# Altium schematic sheet Sheet2.SchDoc
size A; SheetNumber: 4; SheetTotal: 6
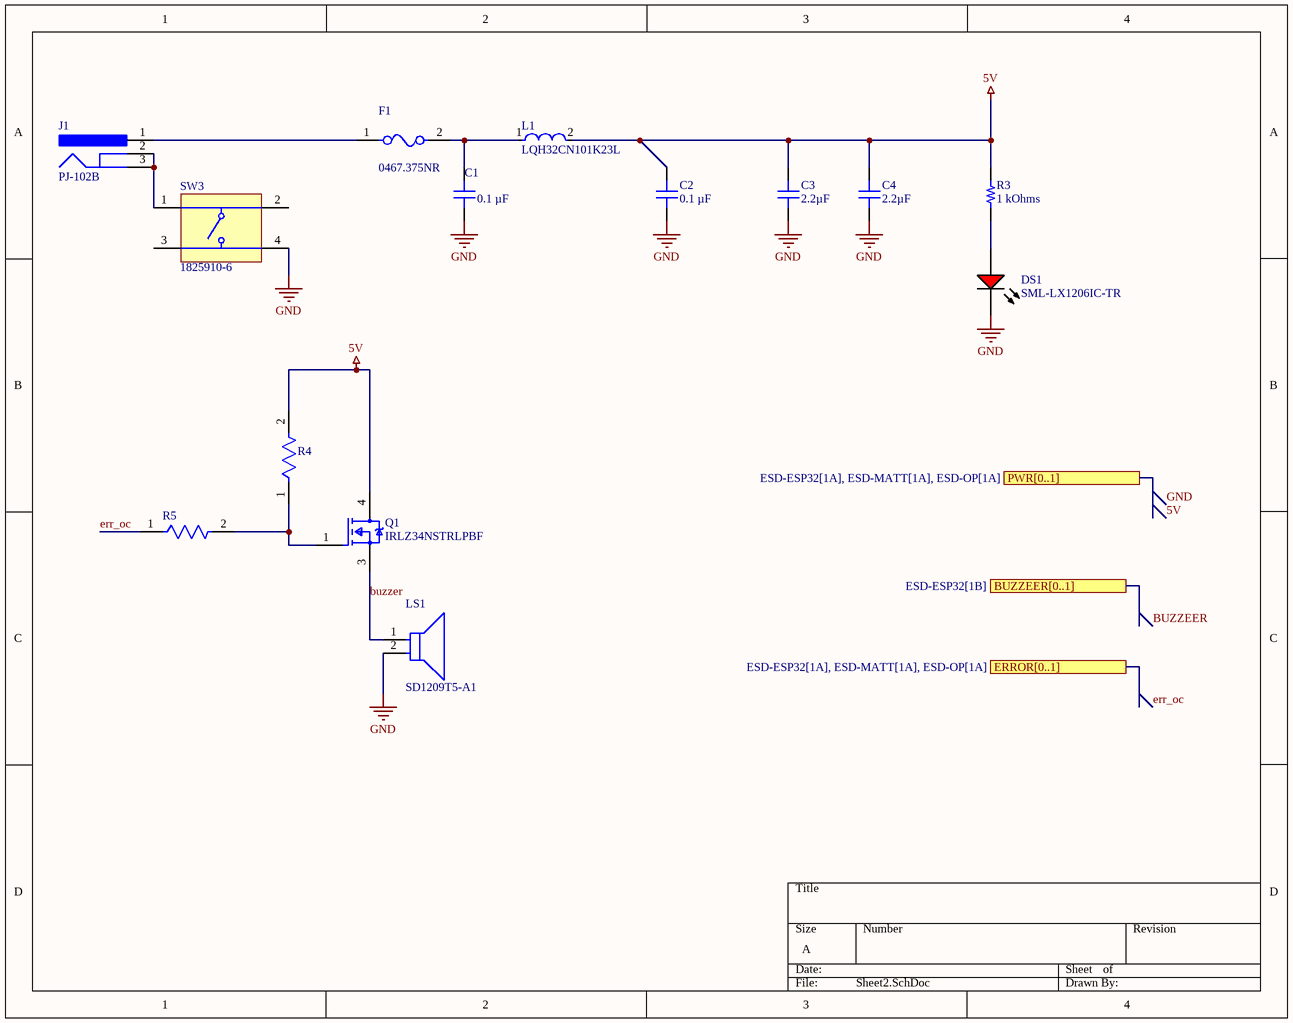
[diagram p0: Sheet2.SchDoc]

## Parts
C1  0.1 µF  [CAP 0603_1608]
C2  0.1 µF  [CAP 0603_1608]
C3  2.2µF  [CAP 0603_1608]
C4  2.2µF  [CAP 0603_1608]
DS1  SML-LX1206IC-TR  [LUMX-SML-LX1206IC_V]
F1  0467.375NR  [FP-467-MFG]
J1  PJ-102B  [CUI-PJ-102B_V]
L1  LQH32CN101K23L  [FP-LQH32CH_23-MFG]
LS1  SD1209T5-A1  [FP-SD1209-MFG]
Q1  IRLZ34NSTRLPBF  [FP-PG-TO263-3-MFG]
R3  1 kOhms  [KOA RES RK73 RN73 0402_1005]
R4  AC0603FR-072KL  [FP-AC0603-IPC_B]  (value not drawn)
R5  AC0603FR-072KL  [FP-AC0603-IPC_B]  (value not drawn)
SW3  1825910-6  [TECO-1825910-6_V]

## Ports
BUZZEER[0..1] (see ESD-ESP32[1B]), ERROR[0..1] (see ESD-ESP32[1A], ESD-MATT[1A], ESD-OP[1A]), PWR[0..1] (see ESD-ESP32[1A], ESD-MATT[1A], ESD-OP[1A])

## Nets
5V: C2.2 C3.2 C4.2 L1.2 Q1.4(D) R3.2 R4.2
GND: C1.1 C2.1 C3.1 C4.1 DS1.2(K) LS1.2(A) SW3.4
buzzer: LS1.1(C) Q1.3(S)
err_oc: R5.1
NetC1_2: C1.2 F1.2 L1.1
NetDS1_1: DS1.1(A) R3.1
NetF1_1: F1.1 J1.1
NetJ1_2: J1.2 J1.3 SW3.1
NetQ1_1: Q1.1(G) R4.1 R5.2

Not connected (* = marked no-connect by the designer): SW3 2 3

## Notes on the sheet
- Labels drawn without touching a wire or pin: 5V, BUZZEER, err_oc, GND

## Library data of the parts
C1 C2 = C0603X104J5RACAUTO: CAP CER 0.1UF 50V X7R 0603; manufacturer: KEMET; Tolerance: ±5%; Part Number: C0603X104J5RACAUTO; Value: 0.1 µF; Applications: Automotive, Boardflex Sensitive; Capacitance: 0.1 µF; componentlink1description: Datasheet; componentlink1url: https://api.kemet.com/component-edge/download/specsheet/C0603X104J5RACAUTO.pdf; componentlink2description: DigiKey Link; componentlink2url: https://www.digikey.com/en/products/detail/kemet/C0603X104J5RACAUTO/3314905; Device Package: 0603 (1608 Metric); Features: Soft Termination; lastupdated: 2/9/2024 8:10:26 PM; Lifecycle Status: Active; Minimum Order: 1; Mounting Type: Surface Mount, MLCC; Operating Temperature: -55°C ~ 125°C; Package / Case: 0603 (1608 Metric); packaging: TapeAndReel; partid: 40909; Part Status: Active; price: 0.12; Ratings: AEC-Q200; series: SMD Auto X7R Flex; Size / Dimension: 0.063" L x 0.031" W (1.60mm x 0.80mm); Supplier 1: DigiKey; Supplier Part Number 1: 399-6910-1-ND; Temperature Coefficient: X7R; Thickness (Max): 0.037" (0.95mm); Voltage - Rated: 50V
C3 C4 = 0603ZC225KAT2A: CAP CER 2.2UF 10V X7R 0603; manufacturer: AVX Corporation; Tolerance: ±10%; Part Number: 0603ZC225KAT2A; Value: 2.2µF; Applications: General Purpose; Capacitance: 2.2µF; componentlink1description: Datasheet; componentlink1url: http://datasheets.avx.com/X7RDielectric.pdf; componentlink2description: DigiKey Link; componentlink2url: http://digikey.com/product-detail/en/avx-corporation/0603ZC225KAT2A/478-11618-1-ND/8564176; Device Package: 0603 (1608 Metric); lastupdated: 9/2/2020 1:03:15 AM; Lifecycle Status: Active; Minimum Order: 1; Mounting Type: Surface Mount, MLCC; Operating Temperature: -55°C ~ 125°C; Package / Case: 0603 (1608 Metric); packaging: TapeAndReel; partid: 13741; Part Status: Active; price: 0.37; series: -; Size / Dimension: 0.063" L x 0.032" W (1.60mm x 0.81mm); Supplier 1: DigiKey; Supplier Part Number 1: 478-11618-1-ND; Temperature Coefficient: X7R; Thickness (Max): 0.037" (0.94mm); Voltage - Rated: 10V
DS1 = CMP-2000-07123-1: LED Red, 65 mW, -40 to 85 degC, 2-Pin SMD, RoHS, Tape and Reel; Manufacturer: Lumex; LED Material: GaAsP; Peak Wavelength: 635nm; Number of LEDs: 1; Viewing Angle: 160; Reverse Voltage: 5(Min)V; Lens Appearance: ColorlessNonDiffused; Intensity: 6mcd; Type: Uni-Color; Pin_Count: 2; Lens Dimensions: 2x1.6x0.5mm; Mounting: SurfaceMount; ECCN: EAR99; RoHS: Unknown; Package Description: 2-Pin Surface Mount Device, Body 3.2 x 1.5 mm; Mounting Technology: SurfaceMount; Dominant Wavelength: N/A; Supplier_Package: SMD; Supplier Standard Pack: 3,000; Color: Red; Dimension: 3.2x1.6x1.1mm; HTS: 8541402000; Part No: SML-LX1206IC-TR; Family: SML-LX1206IC; Supplier: Lumex; Datasheet URL: http://www.lumex.com/content/files/ProductAttachment/SML-LX1206IC-TR.pdf; Package Reference: SML-LX1206IC; Manufacturer URL: http://www.lumexinstruments.com/; Operating Temperature: -25to85C; Packaging: TapeandReel; Datasheet Version: Rev. J, 08/2012
F1 = CMP-08605-000028-1: FUSE BOARD MOUNT 375MA 32VAC/VDC; Manufacturer: Littelfuse; Fuse Current: 0.375A; Fuse Blow Speed: Fast; Max Fuse Dc Voltage: 32V; Fuse I2T: 0.0035A2Sec; Fuse Interrupt Dc Current: 50A; Octopart: https://octopart.com/0467.375nr-littelfuse-565971; Temperature: -55°C to +90°C; Mouser Description: Surface Mount Fuses 32V.375A VFA Slimline; Automotive: No; Category: Fuse; Temperature Range Low: -55°C; ComponentLink2Description: Datasheet; Max Fuse Ac Voltage: 32V; Lead Free: Yes; Package: 467; Manufacturer Part Number: 0467.375NR; Height: 0.432mm; RoHS: TRUE; ComponentLink2URL: https://www.littelfuse.com/~/media/electronics/datasheets/fuses/littelfuse_fuse_467_datasheet.pdf.pdf; Temperature Range High: +90°C; Device Class L1: Circuit Protection; Voltage Rating: 32V; Device Class L2: Fuses; Fuse Interrupt Ac Current: 50A; Digikey Description: FUSE BOARD MOUNT 375MA 32VAC/VDC; Device Class L3: unset
J1 = CMP-2000-06900-1: Through Hole Right Angle DC Power Jack, 2.5 A, 2.5 mm Center Pin, 3 Position, -25 to 85 degC, RoHS, Bulk; Manufacturer: CUIInc.; Insulation Resistance: 100MOhms; Inside Contact Diameter: 2.5mm; Outside Contact Diameter: 6.5mm; Voltage Rating: 24V; Current Rating: 2.5A; Brand: CUI; Datasheet URL: http://www.cui.com/product/resource/pj-102b.pdf; Housing Material: PolybutyleneTerephthalate(PBT); Operating Temperature Range: -25Cto+85C; Package Reference: PJ-102B; Factory Pack Quantity: 280; RoHS: True; Contact Material: Copper; Datasheet Version: Rev. 1.03, 04/2016; Product: Jacks; Mounting Angle: Right; Mounting Style: ThroughHole; Flammability Rating: UL94V-0; Product Category: DCPowerConnectors; Contact Gender: Male; Termination Style: ThroughHole; Manufacturer URL: http://www.cui.com/; Mounting Technology: ThroughHole; Package Description: 3-Pin Through Hole Device, Body 14.4 x 9 mm, Height 11 mm; Contact Plating: Nickel; Packaging: Bulk; Connector Type: DCPowerJack
L1 = CMP-06042-006648-2: Wire Wound Ferrite Inductor for Power Lines 100μH ±10% 4.55Ω 100mA 1210; Q Factor: 40; Current: 1.1A; Self Resonant Frequency: 10MHz; Shielding: Unshielded; DC Resistance (DCR): 3.5R; Test Frequency: 1MHz; Inductance: 100uH; Case Code (Imperial): 1210; Lead Free: Lead Free; Military Standard: Not; Mount: Surface Mount; REACH SVHC: No SVHC; Max Operating Temperature: 85°C; DC Current: 100mA; Weight: 0.002116oz; Radiation Hardening: No; Inductance Tolerance: 10%; Number of Pins: 2; Packaging: Tape and Reel; Rated Current-Max: 100mA; Termination: SMD/SMT; Max DC Current: 100mA; Current Rating: 100mA; Width: 2.5mm; Height: 2mm; Core Material: Ferrite; RoHS Compliant: Yes; Frequency: 10MHz; Package Quantity: 2000; Series: LQH32C_33; Case/Package: 1210; Length: 3.2mm; Tolerance: 10%; Min Operating Temperature: -40°C; Case Code (Metric): 3225; Depth: 2.7mm; Inductor Type: Wirewound
LS1 = CMP-08413-000009-1: AUDIO MAGNETIC XDCR 3-6V TH; Max Supply Current: 60mA; Number of Terminals/Pins: 2; Frequency: 2.048kHz; Washable: No; Operating Supply Voltage: 5V; Self Resonant Frequency: 2.05kHz; Min Operating Temperature: -40°C; Operating Supply Current: 60mA; Diameter: 12mm; Package Quantity: 100; Max Operating Temperature: 85°C; Sensing Method: Magnetic; Series: SD; Current Rating: 60mA; Lead Free: Lead Free; Height: 9mm; Packaging: Tray; Termination: PC Pins; Number of Pins: 2; Voltage Rating (DC): 5V; Mount: Through Hole
Q1 = CMP-32901-001250-1: MOSFET N-CH 55V 30A D2PAK; Turn-On Delay Time: 8.9ns; Drain to Source Resistance: 60mR; Rds On Max: 35mR; Power Dissipation: 68W; Max Power Dissipation: 3.8W; Gate to Source Voltage (Vgs): 16V; Input Capacitance: 880pF; Element Configuration: Single; Turn-Off Delay Time: 21ns; Threshold Voltage: 2V; Case/Package: D2PAK; Halogen Free: Halogen Free; Number of Pins: 3; Mount: Surface Mount; Height: 0.19inch; Lead Free: Contains Lead; RoHS Compliant: Yes; Min Operating Temperature: -55°C; Width: 0.38inch; Max Operating Temperature: 175°C; Packaging: Cut Tape; Reach SVHC Compliant: Yes; Length: 0.42inch; Drain to Source Voltage (Vdss): 55V; Continuous Drain Current (ID): 30A; Series: HEXFET®; Max Dual Supply Voltage: 55V
R3 = RK73H1ETTPB1001F: RES 1K OHM 1% 1/10W 0402; Manufacturer: KOA Speer Electronics, Inc.; Power (Watts): 0.1W, 1/10W; Temperature Coefficient: ±100ppm/°C; Part Number: RK73H1ETTPB1001F; Value: 1 kOhms; ComponentLink1Description: Datasheet; ComponentLink1URL: https://www.koaspeer.com/pdfs/RK73H.pdf; ComponentLink2Description: DigiKey Link; ComponentLink2URL: https://www.digikey.com/en/products/detail/koa-speer-electronics-inc/RK73H1ETTPB1001F/21680129; Composition: Thick Film; Device Package: 0402 (1005 Metric); Features: Automotive AEC-Q200; Height - Seated (Max): 0.016" (0.40mm); LastUpdated: 7/25/2024 9:41:20 AM; Lifecycle Status: Active; Minimum Order: 1; Number of Terminations: 2; Operating Temperature: -55°C ~ 155°C; Package / Case: 0402 (1005 Metric); Packaging: CutTape; PartId: 89462; Price: 0.01; Ratings: AEC-Q200; Resistance: 1 kOhms; Series: RK73H; Size / Dimension: 0.039" L x 0.020" W (1.00mm x 0.50mm); Supplier 1: DigiKey; Supplier Part Number 1: 2019-RK73H1ETTPB1001FCT-ND; Supplier Device Package: 0402; Tolerance: ±1%
R4 R5 = CMP-2000-04836-2: RES 2kΩ 1.00% 0.1W 0603; Resistance: 2kR; Voltage Rating: 50V; Max Power Dissipation: 100mW; Temperature Coefficient: 100ppm/°C; Tolerance: 1%; Height: 0.45mm; Case Code (Imperial): 0603; Number of Terminations: 2; Termination: SMD/SMT; Max Operating Temperature: 155°C; Min Operating Temperature: -55°C; Features: Moisture Resistant; Size Code: 0603; Military Standard: Not; Depth: 0.8mm; Lead Free: Lead Free; Ratings: AEC-Q200; Case Code (Metric): 1608; Power Rating: 100mW; Resistor Type: Thick Film; Length: 1.6mm; Case/Package: 0603; Packaging: Tape and Reel; Width: 0.8mm; Construction: Rectangular; Series: AC
SW3 = CMP-1684-00021-1: Tact Switch, SPST-NO, 0.05 A, -35 to 85 degC, 4-Pin THD, RoHS, Bulk; Manufacturer: TE Connectivity; Maximum Contact Resistance: 100mOhm; Mechanical Life: 100000Cycles; Bushing Type: Unthreaded; Switch Configuration: OFF(ON); Maximum DC Voltage Rating: 24V; Contact Rating @ Voltage: 0.05A@24VDC; Actuator Color: Black; Body Orientation: Straight; Function: MomentaryContact; Illumination: N/R; Actuator Style: RoundButton; Actuator Material: PolybutyleneTerephthalate; Dielectric Strength: 500VAC; Pole Throw Configuration: SPST; Actuator Length: 1.4mm; Product Weight: N/A; Contact Material: CopperAlloy; Housing Material: N/A; Terminal Type: PCPins; Minimum Insulation Resistance: 100MOhm; Package Description: 4-Pin Through Hole Device, Body 5.99 x 5.99 mm, Pitch 6.5 mm; Part No: 1825910-6; Package Reference: THD; Base Material: N/A; Manufacturer URL: http://www.te.com; Contact Plating: Silver; RoHS: Yes; Datasheet Version: Rev. C9; Electrical Life: 100000Cycles; Maximum AC Voltage Rating: N/A; Thread Size: N/R; Operating Temperature: -35to85C; Mounting: ThroughHole; Dimension: 5.99x5mm; Datasheet URL: http://www.te.com/commerce/DocumentDelivery/DDEController?Action=showdoc&DocId=Customer+Drawing%7F1825910%7FC9%7Fpdf%7FEnglish%7FENG_CD_1825910_C9.pdf%7F1825910-6; Family: 1825910; Seal Location: N/A; Seal Description: N/A; Packaging: N/A